# EAGLE design placaLeandro2 (EAGLE 7.6.0)
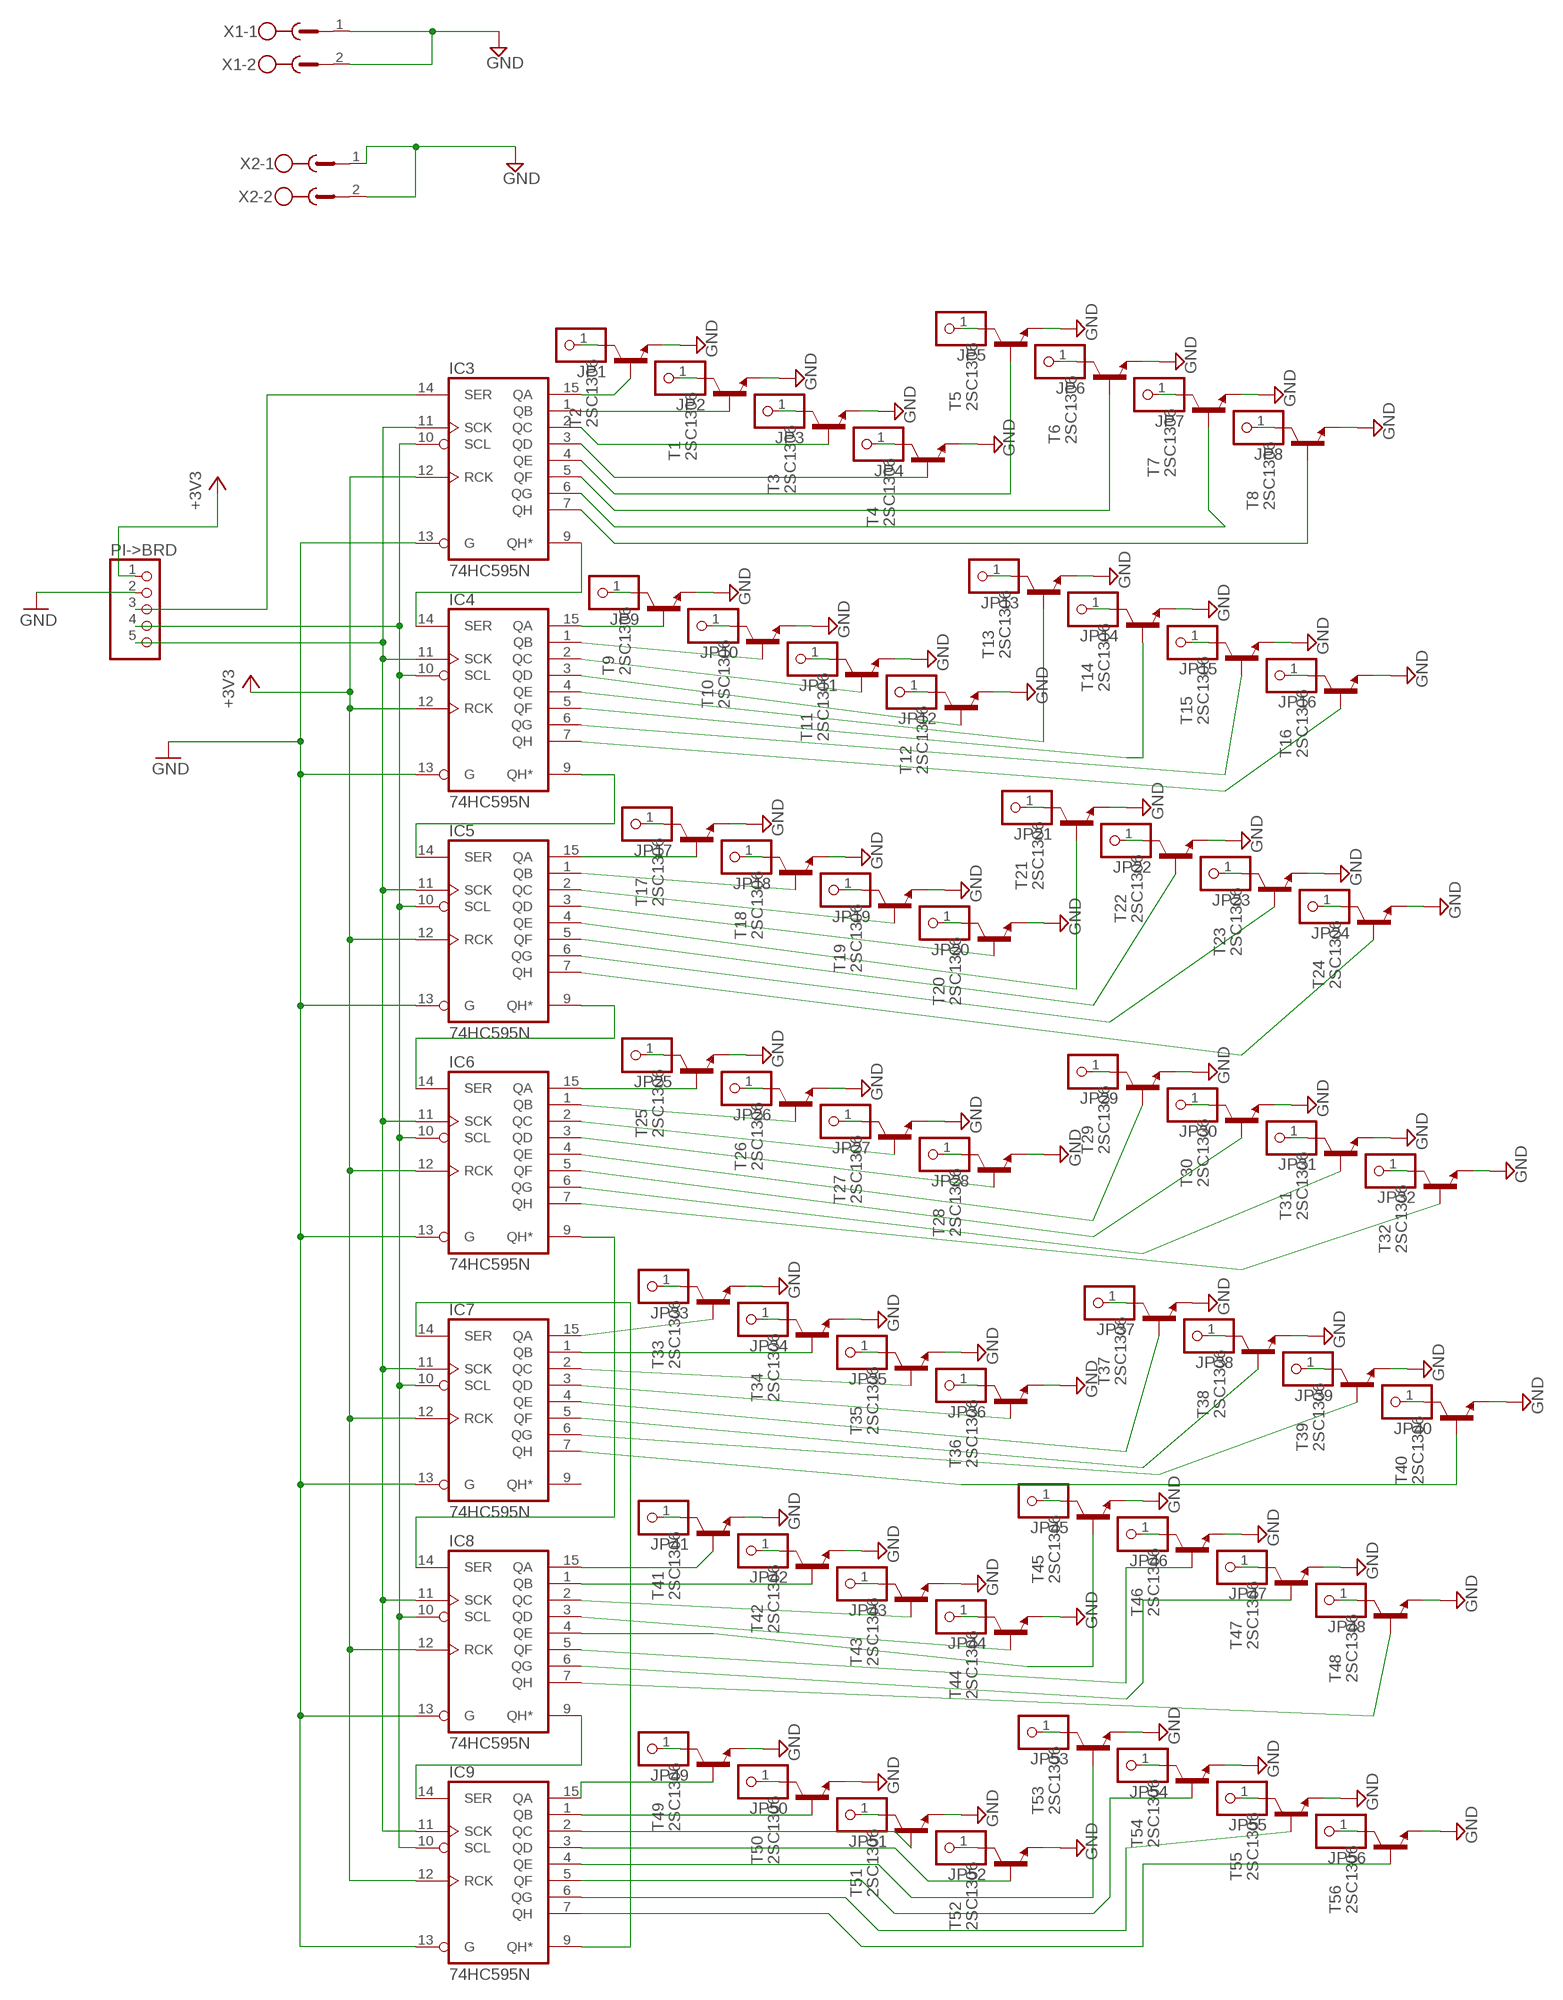
[diagram p0: schematic, sheet 1]

## Parts
IC3  74HC595N  [DIL16]
IC4  74HC595N  [DIL16]
IC5  74HC595N  [DIL16]
IC6  74HC595N  [DIL16]
IC7  74HC595N  [DIL16]
IC8  74HC595N  [DIL16]
IC9  74HC595N  [DIL16]
JP1  PINHD-1X1  [1X01]
JP2  PINHD-1X1  [1X01]
JP3  PINHD-1X1  [1X01]
JP4  PINHD-1X1  [1X01]
JP5  PINHD-1X1  [1X01]
JP6  PINHD-1X1  [1X01]
JP7  PINHD-1X1  [1X01]
JP8  PINHD-1X1  [1X01]
JP9  PINHD-1X1  [1X01]
JP10  PINHD-1X1  [1X01]
JP11  PINHD-1X1  [1X01]
JP12  PINHD-1X1  [1X01]
JP13  PINHD-1X1  [1X01]
JP14  PINHD-1X1  [1X01]
JP15  PINHD-1X1  [1X01]
JP16  PINHD-1X1  [1X01]
JP17  PINHD-1X1  [1X01]
JP18  PINHD-1X1  [1X01]
JP19  PINHD-1X1  [1X01]
JP20  PINHD-1X1  [1X01]
JP21  PINHD-1X1  [1X01]
JP22  PINHD-1X1  [1X01]
JP23  PINHD-1X1  [1X01]
JP24  PINHD-1X1  [1X01]
JP25  PINHD-1X1  [1X01]
JP26  PINHD-1X1  [1X01]
JP27  PINHD-1X1  [1X01]
JP28  PINHD-1X1  [1X01]
JP29  PINHD-1X1  [1X01]
JP30  PINHD-1X1  [1X01]
JP31  PINHD-1X1  [1X01]
JP32  PINHD-1X1  [1X01]
JP33  PINHD-1X1  [1X01]
JP34  PINHD-1X1  [1X01]
JP35  PINHD-1X1  [1X01]
JP36  PINHD-1X1  [1X01]
JP37  PINHD-1X1  [1X01]
JP38  PINHD-1X1  [1X01]
JP39  PINHD-1X1  [1X01]
JP40  PINHD-1X1  [1X01]
JP41  PINHD-1X1  [1X01]
JP42  PINHD-1X1  [1X01]
JP43  PINHD-1X1  [1X01]
JP44  PINHD-1X1  [1X01]
JP45  PINHD-1X1  [1X01]
JP46  PINHD-1X1  [1X01]
JP47  PINHD-1X1  [1X01]
JP48  PINHD-1X1  [1X01]
JP49  PINHD-1X1  [1X01]
JP50  PINHD-1X1  [1X01]
JP51  PINHD-1X1  [1X01]
JP52  PINHD-1X1  [1X01]
JP53  PINHD-1X1  [1X01]
JP54  PINHD-1X1  [1X01]
JP55  PINHD-1X1  [1X01]
JP56  PINHD-1X1  [1X01]
PI->BRD  PINHD-1X5  [1X05]
T1  2SC1306  [TO220BV]
T2  2SC1306  [TO220BV]
T3  2SC1306  [TO220BV]
T4  2SC1306  [TO220BV]
T5  2SC1306  [TO220BV]
T6  2SC1306  [TO220BV]
T7  2SC1306  [TO220BV]
T8  2SC1306  [TO220BV]
T9  2SC1306  [TO220BV]
T10  2SC1306  [TO220BV]
T11  2SC1306  [TO220BV]
T12  2SC1306  [TO220BV]
T13  2SC1306  [TO220BV]
T14  2SC1306  [TO220BV]
T15  2SC1306  [TO220BV]
T16  2SC1306  [TO220BV]
T17  2SC1306  [TO220BV]
T18  2SC1306  [TO220BV]
T19  2SC1306  [TO220BV]
T20  2SC1306  [TO220BV]
T21  2SC1306  [TO220BV]
T22  2SC1306  [TO220BV]
T23  2SC1306  [TO220BV]
T24  2SC1306  [TO220BV]
T25  2SC1306  [TO220BV]
T26  2SC1306  [TO220BV]
T27  2SC1306  [TO220BV]
T28  2SC1306  [TO220BV]
T29  2SC1306  [TO220BV]
T30  2SC1306  [TO220BV]
T31  2SC1306  [TO220BV]
T32  2SC1306  [TO220BV]
T33  2SC1306  [TO220BV]
T34  2SC1306  [TO220BV]
T35  2SC1306  [TO220BV]
T36  2SC1306  [TO220BV]
T37  2SC1306  [TO220BV]
T38  2SC1306  [TO220BV]
T39  2SC1306  [TO220BV]
T40  2SC1306  [TO220BV]
T41  2SC1306  [TO220BV]
T42  2SC1306  [TO220BV]
T43  2SC1306  [TO220BV]
T44  2SC1306  [TO220BV]
T45  2SC1306  [TO220BV]
T46  2SC1306  [TO220BV]
T47  2SC1306  [TO220BV]
T48  2SC1306  [TO220BV]
T49  2SC1306  [TO220BV]
T50  2SC1306  [TO220BV]
T51  2SC1306  [TO220BV]
T52  2SC1306  [TO220BV]
T53  2SC1306  [TO220BV]
T54  2SC1306  [TO220BV]
T55  2SC1306  [TO220BV]
T56  2SC1306  [TO220BV]
X1  MSTBV2  [MSTBV2]
X2  MSTBV2  [MSTBV2]

## Nets
+3V3: IC3.12(RCK) IC4.12(RCK) IC5.12(RCK) IC6.12(RCK) IC7.12(RCK) IC8.12(RCK) IC9.12(RCK) PI->BRD.1
GND: IC3.13(G) IC4.13(G) IC5.13(G) IC6.13(G) IC7.13(G) IC8.13(G) IC9.13(G) PI->BRD.2 T1.3(E) T2.3(E) T3.3(E) T4.3(E) T5.3(E) T6.3(E) T7.3(E) T8.3(E) T9.3(E) T10.3(E) T11.3(E) T12.3(E) T13.3(E) T14.3(E) T15.3(E) T16.3(E) T17.3(E) T18.3(E) T19.3(E) T20.3(E) T21.3(E) T22.3(E) T23.3(E) T24.3(E) T25.3(E) T26.3(E) T27.3(E) T28.3(E) T29.3(E) T30.3(E) T31.3(E) T32.3(E) T33.3(E) T34.3(E) T35.3(E) T36.3(E) T37.3(E) T38.3(E) T39.3(E) T40.3(E) T41.3(E) T42.3(E) T43.3(E) T44.3(E) T45.3(E) T46.3(E) T47.3(E) T48.3(E) T49.3(E) T50.3(E) T51.3(E) T52.3(E) T53.3(E) T54.3(E) T55.3(E) T56.3(E) X1.1 X1.2 X2.1 X2.2
N$1: IC6.9(QH*) IC8.14(SER)
N$2: IC3.9(QH*) IC4.14(SER)
N$3: IC4.9(QH*) IC5.14(SER)
N$4: IC5.9(QH*) IC6.14(SER)
N$5: IC8.9(QH*) IC9.14(SER)
N$6: IC7.14(SER) IC9.9(QH*)
N$7: IC3.11(SCK) IC4.11(SCK) IC5.11(SCK) IC6.11(SCK) IC7.11(SCK) IC8.11(SCK) IC9.11(SCK) PI->BRD.5
N$8: IC3.10(SCL) IC4.10(SCL) IC5.10(SCL) IC6.10(SCL) IC7.10(SCL) IC8.10(SCL) IC9.10(SCL) PI->BRD.4
N$9: JP1.1 T2.2(C)
N$10: JP2.1 T1.2(C)
N$11: JP3.1 T3.2(C)
N$12: IC3.14(SER) PI->BRD.3
N$13: JP4.1 T4.2(C)
N$14: JP5.1 T5.2(C)
N$15: JP6.1 T6.2(C)
N$16: JP7.1 T7.2(C)
N$17: JP8.1 T8.2(C)
N$18: JP9.1 T9.2(C)
N$19: JP10.1 T10.2(C)
N$20: JP11.1 T11.2(C)
N$21: JP12.1 T12.2(C)
N$22: JP13.1 T13.2(C)
N$23: JP14.1 T14.2(C)
N$24: JP15.1 T15.2(C)
N$25: JP16.1 T16.2(C)
N$26: JP17.1 T17.2(C)
N$27: JP18.1 T18.2(C)
N$28: JP19.1 T19.2(C)
N$29: JP20.1 T20.2(C)
N$30: JP21.1 T21.2(C)
N$31: JP22.1 T22.2(C)
N$32: JP23.1 T23.2(C)
N$33: JP24.1 T24.2(C)
N$34: JP25.1 T25.2(C)
N$35: JP26.1 T26.2(C)
N$36: JP27.1 T27.2(C)
N$37: JP28.1 T28.2(C)
N$38: JP29.1 T29.2(C)
N$39: JP30.1 T30.2(C)
N$40: JP31.1 T31.2(C)
N$41: JP32.1 T32.2(C)
N$42: JP33.1 T33.2(C)
N$43: JP34.1 T34.2(C)
N$44: JP35.1 T35.2(C)
N$45: JP36.1 T36.2(C)
N$46: JP37.1 T37.2(C)
N$47: JP38.1 T38.2(C)
N$48: JP39.1 T39.2(C)
N$49: JP40.1 T40.2(C)
N$50: JP41.1 T41.2(C)
N$51: JP42.1 T42.2(C)
N$52: JP43.1 T43.2(C)
N$53: JP44.1 T44.2(C)
N$54: JP45.1 T45.2(C)
N$55: JP46.1 T46.2(C)
N$56: JP47.1 T47.2(C)
N$57: JP48.1 T48.2(C)
N$58: JP49.1 T49.2(C)
N$59: JP50.1 T50.2(C)
N$60: JP51.1 T51.2(C)
N$61: JP52.1 T52.2(C)
N$62: JP53.1 T53.2(C)
N$63: JP54.1 T54.2(C)
N$64: JP55.1 T55.2(C)
N$65: JP56.1 T56.2(C)
N$67: IC3.1(QB) T1.1(B)
N$68: IC3.2(QC) T3.1(B)
N$69: IC3.3(QD) T4.1(B)
N$70: IC3.4(QE) T5.1(B)
N$71: IC3.5(QF) T6.1(B)
N$72: IC3.6(QG) T7.1(B)
N$73: IC3.7(QH) T8.1(B)
N$74: IC4.15(QA) T9.1(B)
N$75: IC4.1(QB) T10.1(B)
N$76: IC4.2(QC) T11.1(B)
N$77: IC4.3(QD) T12.1(B)
N$78: IC4.4(QE) T13.1(B)
N$79: IC4.5(QF) T14.1(B)
N$80: IC4.6(QG) T15.1(B)
N$81: IC4.7(QH) T16.1(B)
N$82: IC5.15(QA) T17.1(B)
N$83: IC5.1(QB) T18.1(B)
N$84: IC5.2(QC) T19.1(B)
N$85: IC5.3(QD) T20.1(B)
N$86: IC5.4(QE) T21.1(B)
N$87: IC5.5(QF) T22.1(B)
N$88: IC5.6(QG) T23.1(B)
N$89: IC5.7(QH) T24.1(B)
N$90: IC6.15(QA) T25.1(B)
N$91: IC6.1(QB) T26.1(B)
N$92: IC6.2(QC) T27.1(B)
N$93: IC6.3(QD) T28.1(B)
N$94: IC6.4(QE) T29.1(B)
N$95: IC6.5(QF) T30.1(B)
N$96: IC6.6(QG) T31.1(B)
N$97: IC6.7(QH) T32.1(B)
N$98: IC7.15(QA) T33.1(B)
N$99: IC7.1(QB) T34.1(B)
N$100: IC7.2(QC) T35.1(B)
N$101: IC7.3(QD) T36.1(B)
N$102: IC7.4(QE) T37.1(B)
N$103: IC7.5(QF) T38.1(B)
N$104: IC7.6(QG) T39.1(B)
N$105: IC7.7(QH) T40.1(B)
N$106: IC8.15(QA) T41.1(B)
N$107: IC8.1(QB) T42.1(B)
N$108: IC8.2(QC) T43.1(B)
N$109: IC8.3(QD) T44.1(B)
N$110: IC8.4(QE) T45.1(B)
N$111: IC8.5(QF) T46.1(B)
N$112: IC8.6(QG) T47.1(B)
N$113: IC8.7(QH) T48.1(B)
N$114: IC9.15(QA) T49.1(B)
N$115: IC9.1(QB) T50.1(B)
N$116: IC9.2(QC) T51.1(B)
N$117: IC9.3(QD) T52.1(B)
N$118: IC9.4(QE) T53.1(B)
N$119: IC9.5(QF) T54.1(B)
N$120: IC9.6(QG) T55.1(B)
N$121: IC9.7(QH) T56.1(B)
N$122: IC3.15(QA) T2.1(B)
Unconnected: IC7.9(QH*)

## Power pins joined to a net without a drawn wire
GND: IC3.8(GND) IC4.8(GND) IC5.8(GND) IC6.8(GND) IC7.8(GND) IC8.8(GND) IC9.8(GND)
VCC: IC3.16(VCC) IC4.16(VCC) IC5.16(VCC) IC6.16(VCC) IC7.16(VCC) IC8.16(VCC) IC9.16(VCC)

## Library data of the parts
IC3-IC9 = 74xx-eu:74*595: 8-bit SHIFT REGISTER, output latch
JP1-JP56 = pinhead:PINHD-1X1: PIN HEADER
PI->BRD = pinhead:PINHD-1X5: PIN HEADER
T1-T56 = transistor-neu-to92:2SC1306: NPN Transistor Final RF Power Outupt Source: 2sc1306.pdf
X1 X2 = con-phoenix-500:MSTBV2: PHOENIX; OC_FARNELL: unknown; OC_NEWARK: unknown

## Board
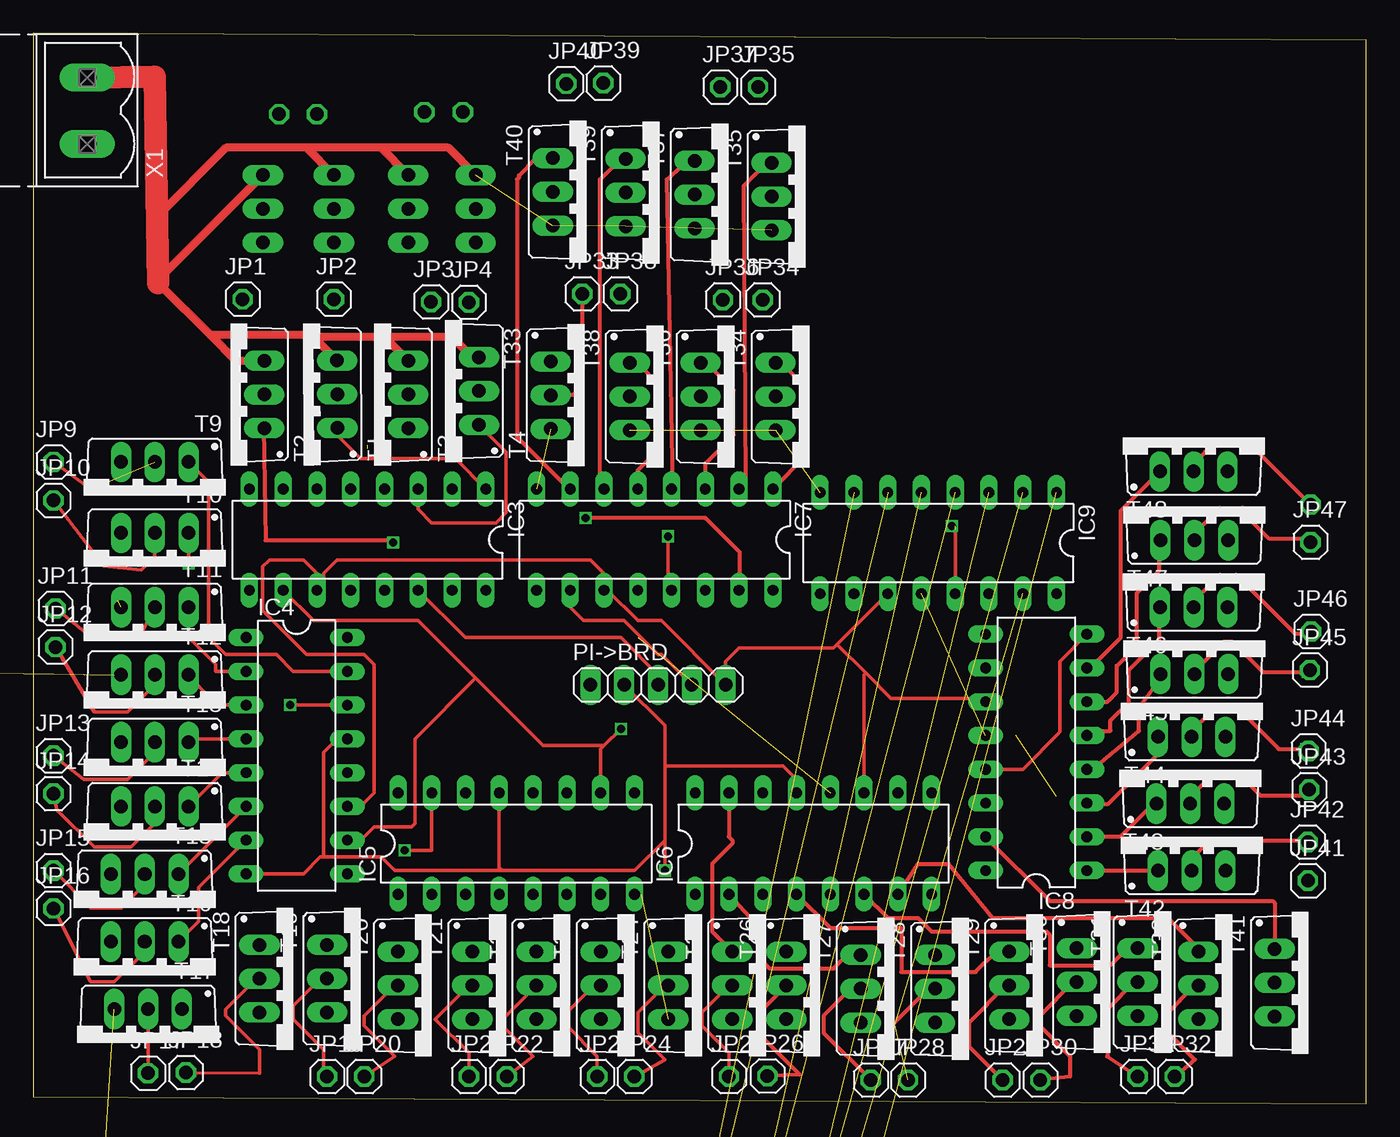
[diagram p1: board, top side]
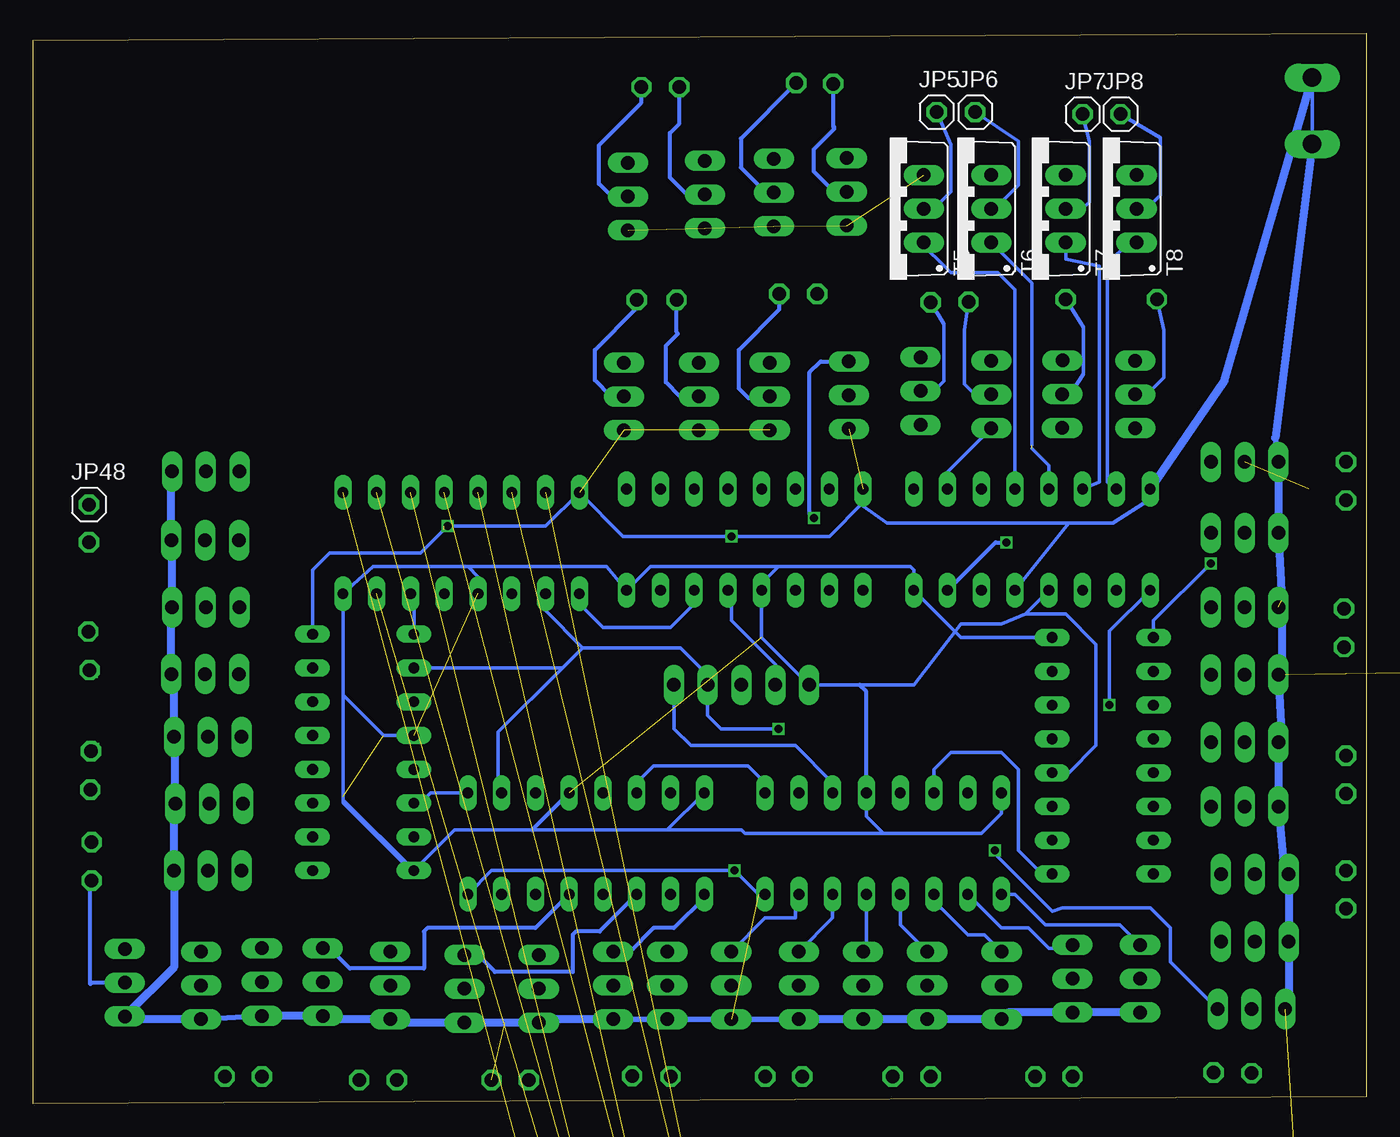
[diagram p2: board, bottom side, seen from below]

Size 100.25 x 80.51 mm. Coordinates in mm from the lower left corner, seen from the top.
Outline: 0,0.51 100.25,0 100.25,80 0,80.51 0,0.51
Copper layers (1*16): Top 0.035mm / dielectric 1.5mm / Bottom 0.035mm
Design rules "SeeedStudio_2layer_DRU_no_angle_20140221 *": minimum track width 8mil, minimum drill 12mil, track to track 10mil, track to pad 10mil, pad to pad 10mil, via to via 10mil, smd to smd 0mil, copper to edge 10mil, drill to drill 10mil, minimum pad ring 10mil, minimum via ring 6mil, stop-mask expansion 2mil, vias tented up to drill 100mil, thermal gap 10mil

### Footprints (pad centres in the part's own frame; a part is rotated, then mirrored left to right if it is on the bottom)
DIL16 = drill 0.813 long: 1 -8.89,-3.81; 2 -6.35,-3.81; 3 -3.81,-3.81; 4 -1.27,-3.81; 5 1.27,-3.81; 6 3.81,-3.81; 7 6.35,-3.81; 8 8.89,-3.81; 9 8.89,3.81; 10 6.35,3.81; 11 3.81,3.81; 12 1.27,3.81; 13 -1.27,3.81; 14 -3.81,3.81; 15 -6.35,3.81; 16 -8.89,3.81
1X01 = drill 1.016 octagon: 1 0,0
1X05 = drill 1.016 long: 1 -5.08,0; 2 -2.54,0; 3 0,0; 4 2.54,0; 5 5.08,0
TO220BV = drill 1.016 long: 1 -2.54,-2.54; 2 0,-2.54; 3 2.54,-2.54
MSTBV2 = drill 1.397 long: 1 -2.5,0; 2 2.5,0

### Placement (x,y rotation side)
IC3  25.15,42.42 180 top
IC4  19.81,26.16 270 top
IC5  36.32,19.56 0 top
IC6  58.67,19.56 0 top
IC7  46.74,42.42 180 top
IC8  75.44,26.42 90 top
IC9  68.07,42.16 180 top
JP1  15.75,60.5 0 top
JP2  22.61,60.5 0 top
JP3  29.92,60.3 0 top
JP4  32.76,60.26 0 top
JP5  32.31,74.57 0 bottom
JP6  29.41,74.57 0 bottom
JP7  21.34,74.42 0 bottom
JP8  18.49,74.42 0 bottom
JP9  1.52,48.26 0 top
JP10  1.52,45.36 0 top
JP11  1.68,37.24 0 top
JP12  1.68,34.34 0 top
JP13  1.52,26.16 0 top
JP14  1.52,23.32 0 top
JP15  1.52,17.53 0 top
JP16  1.52,14.68 0 top
JP17  8.64,2.29 0 top
JP18  11.48,2.34 0 top
JP19  22.1,2.03 0 top
JP20  24.89,2.03 0 top
JP21  32.77,2.03 0 top
JP22  35.61,2.03 0 top
JP23  42.42,2.03 0 top
JP24  45.21,2.03 0 top
JP25  52.32,2.03 0 top
JP26  55.22,2.08 0 top
JP27  62.99,1.78 0 top
JP28  65.79,1.78 0 top
JP29  72.9,1.78 0 top
JP30  75.74,1.78 0 top
JP31  83.06,2.03 0 top
JP32  85.85,2.03 0 top
JP33  41.3,60.91 0 top
JP34  54.86,60.45 0 top
JP35  54.51,76.45 0 top
JP36  51.87,60.45 0 top
JP37  51.66,76.45 0 top
JP38  44.15,60.91 0 top
JP39  42.88,76.76 0 top
JP40  40.08,76.71 0 top
JP41  95.86,16.76 0 top
JP42  95.86,19.66 0 top
JP43  95.96,23.62 0 top
JP44  95.91,26.52 0 top
JP45  96.01,32.61 0 top
JP46  96.11,35.51 0 top
JP47  96.06,42.21 0 top
JP48  96.06,45.06 0 bottom
JP49  -9.91,-343.92 0 top  (outside the outline)
JP50  -32,-353.06 0 top  (outside the outline)
JP51  -27.18,-353.06 0 top  (outside the outline)
JP52  -22.35,-353.06 0 top  (outside the outline)
JP53  -17.53,-353.06 0 top  (outside the outline)
JP54  -12.7,-353.06 0 top  (outside the outline)
JP55  -7.87,-353.06 0 top  (outside the outline)
JP56  -32,-358.14 0 top  (outside the outline)
PI->BRD  46.99,31.5 0 top
T1  20.32,53.34 90.3 top
T2  14.83,53.34 90 top
T3  25.65,53.34 90 top
T4  30.99,53.59 90 top
T5  35.81,67.31 90 bottom
T6  30.73,67.31 90 bottom
T7  25.15,67.31 90 bottom
T8  19.81,67.31 90 bottom
T9  9.14,45.72 180 top
T10  9.14,40.39 180 top
T11  9.14,34.8 180 top
T12  9.14,29.72 180 top
T13  9.14,24.64 180 top
T14  9.14,19.81 180 top
T15  8.38,14.73 180 top
T16  8.38,9.65 180 top
T17  8.64,4.57 180 top
T18  19.56,9.4 270 top
T19  24.64,9.4 270 top
T20  29.97,8.89 270 top
T21  35.56,8.89 270 top
T22  40.39,8.89 270 top
T23  45.21,8.89 270 top
T24  50.29,8.89 270 top
T25  55.12,8.89 270 top
T26  59.18,8.89 270 top
T27  64.77,8.64 270 top
T28  70.36,8.64 270 top
T29  75.95,8.89 270 top
T30  81.03,9.14 270 top
T31  85.6,9.14 270 top
T32  90.17,8.89 270 top
T33  41.45,53.29 270 top
T34  58.37,53.19 270 top
T35  58.06,68.22 270 top
T36  52.73,53.19 270 top
T37  52.27,68.38 270 top
T38  47.4,53.19 270 top
T39  47.09,68.53 270 top
T40  41.61,68.58 270 top
T41  95.91,9.09 270 top
T42  87.12,20.07 0 top
T43  87.02,25.1 0 top
T44  87.12,30.12 0 top
T45  87.33,34.85 0 top
T46  87.27,39.88 0 top
T47  87.33,44.91 0 top
T48  87.27,50.09 0 top
T49  -28.19,-313.94 0 top  (outside the outline)
T50  -17.27,-313.94 0 top  (outside the outline)
T51  -28.19,-323.09 0 top  (outside the outline)
T52  -17.27,-323.09 0 top  (outside the outline)
T53  -28.19,-332.23 0 top  (outside the outline)
T54  -17.27,-332.23 0 top  (outside the outline)
T55  -28.19,-341.38 0 top  (outside the outline)
T56  -17.27,-341.38 0 top  (outside the outline)
X1  4.06,74.68 90 top
X2  -28.19,32.77 0 top  (outside the outline)

### Tracks (layer width: path | path; a pad name or v marks a point on that pad's centre or on a via)
+3V3  (3 unrouted)
  Bottom 0.254: 25.65,36.83 27.43,36.07 30.48,36.07 34.04,31.5 38.1,31.5 PI->BRD.1 45.47,35.05 IC7.12 45.47,39.12 44.2,40.39 44.45,40.39 | 25.65,36.83 IC3.12 | 36.32,20.32 37.59,21.59 IC5.12 | IC9.12 66.8,39.62 67.56,40.39 | IC8.12 73.91,27.69 76.96,30.73 | IC4.12 22.35,24.89 20.32,26.92 20.32,34.54 22.61,36.83 25.65,36.83 | 62.74,20.57 68.58,20.57 71.63,17.53 71.63,17.27 76.96,22.61 76.96,23.11
  Bottom 0.305: IC5.12 37.59,30.99 38.1,31.5 | IC6.12 62.74,20.57
GND  (via drill 0.6)  (21 unrouted)
  Top 0.254: v69.09,43.43 69.34,43.43 IC9.13 | IC7.13 47.75,38.86 v47.75,42.67 | IC8.8 77.22,33.27 77.22,27.94 74.42,25.15 IC8.13 | PI->BRD.2 47.5,28.45 47.5,25.4 | 47.5,25.4 47.5,19.81 | 47.5,19.81 v47.5,17.53 | IC6.13 57.4,24.38 56.39,25.4 47.5,25.4 | 35.31,17.53 27.18,17.53 26.16,18.54 21.84,18.54 | 35.31,17.53 45.21,17.53 47.5,19.81 | IC5.13 35.05,17.78 35.31,17.53 | IC4.8 20.32,17.27 21.59,18.54 21.84,18.54 | IC4.13 22.86,27.43 21.84,26.42 21.84,18.54
  Top 0.61: 9.53,61.59 9.4,61.72 9.4,66.8 14.48,71.88 20.57,71.88 | 9.53,61.59 13.33,57.78 | 13.33,57.78 15.24,55.88 T2.3 | T8.3 9.65,62.23 9.65,61.72 9.53,61.59 | T7.3 20.57,71.88 | T1.3 21.08,57.66 | 21.08,57.66 20.96,57.78 13.33,57.78 | T3.3 26.42,57.66 | 26.42,57.66 21.08,57.66 | T4.3 33.02,56.13 31.5,57.66 26.42,57.66 | T6.3 26.16,71.88 | 26.16,71.88 20.57,71.88 | T5.3 31.24,71.88 26.16,71.88
  Top 1.676: X1.2 9.14,77.26 9.4,61.72
  Bottom 0.254: IC3.8 16.26,45.47 19.05,43.69 22.35,43.69 | 22.35,43.69 IC3.13 | IC7.8 37.85,45.21 | 37.85,45.21 37.85,44.96 36.07,43.69 22.35,43.69 | 37.85,45.21 40.39,42.67 v47.75,42.67 55.88,42.67 IC9.8 61.72,43.43 v69.09,43.43 | 69.34,43.18 71.12,41.4 77.98,41.4 79.25,40.13 IC8.8 | IC5.8 45.72,15.75 v47.5,17.53 65.79,17.53 IC6.8 | PI->BRD.2 44.45,33.02 47.75,36.32 47.75,38.35 IC7.13 | X1.2 X1.1
  Bottom 0.406: 6.86,50.08 T9.3 | 6.35,32.51 6.1,32.26 T12.3 | 6.35,27.18 T13.3 | 6.1,16.51 T15.3 | 5.84,7.37 T17.3 | T23.3 T24.3 T25.3 T26.3 | T31.3 T32.3
  Bottom 0.61: IC3.8 10.67,54.36 X1.2 | X1.1 6.86,50.08 | T9.3 T10.3 6.35,37.85 6.35,32.51 | T12.3 6.35,27.18 | T13.3 T14.3 6.1,16.51 | T15.3 T16.3 5.84,7.37 | T18.3 T19.3 26.92,6.86 T20.3 T21.3 T22.3 T23.3 | T26.3 61.98,6.35 T27.3 T28.3 73.15,6.1 T29.3 78.23,6.35 T30.3 T31.3 | T32.3 93.17,6.35 T41.3 89.66,10.26 T42.3 89.66,22.45 T43.3 89.56,27.48 T44.3 89.66,32.11 T45.3 89.87,37.29 T46.3 89.81,42.32 T47.3 89.87,47.5 T48.3
N$1
  Bottom 0.254: IC6.9 70.36,23.37 71.63,22.1 IC8.14
N$2  (via drill 0.6)
  Top 0.254: IC4.14 v19.3,29.97
  Bottom 0.254: v19.3,29.97 19.3,35.56 IC3.9
N$3
  Bottom 0.254: IC4.9 24.38,17.27 26.16,19.05 26.16,25.15 27.43,26.42 31.24,26.42 32.51,25.15 IC5.14
N$4
  Bottom 0.254: IC5.9 45.21,24.13 46.48,25.4 53.59,25.4 54.86,24.13 IC6.14
N$5
  Bottom 0.254: IC8.9 71.63,38.1 IC9.14
N$6
  Bottom 0.254: IC9.9 59.18,37.59 57.4,35.81 52.32,35.81 50.29,37.85 50.29,38.35 IC7.14
N$7
  Top 0.254: 60.45,34.54 60.2,34.29 53.09,34.29 52.07,33.27 PI->BRD.5 47.24,36.32 45.47,36.32 43.18,38.61 IC7.11 42.93,39.88 41.91,40.89 22.86,40.89 21.84,39.88 21.84,38.61 IC3.11 21.34,39.88 20.32,40.89 17.78,40.89 17.27,40.39 17.27,37.08 20.57,33.78 24.89,33.78 25.65,33.02 25.65,23.37 24.64,22.35 IC4.11 | 60.45,34.54 IC9.11 | IC8.11 71.63,30.48 64.52,30.48 62.61,32.38 | 62.61,32.38 60.45,34.54 | IC6.11 62.48,32.26 62.61,32.38
  Bottom 0.254: IC5.11 40.13,24.13 42.93,26.92 50.8,26.92 52.07,28.19 PI->BRD.5
N$8  (via drill 0.6)
  Top 0.254: IC7.10 40.39,37.34 41.4,36.32 44.45,36.32 46.99,33.78 47.24,33.78 PI->BRD.4 | v44.2,28.19 42.93,26.92 | 42.93,26.92 42.67,26.67 IC5.10 | IC3.10 21.08,36.32 28.96,36.32 33.27,32 | 33.27,32 38.35,26.92 42.93,26.92 | IC4.10 24.64,19.81 25.65,20.83 28.45,20.83 28.7,21.08 28.7,27.43 33.27,32
  Bottom 0.254: IC9.10 61.72,37.08 58.93,34.29 | 58.93,34.29 51.56,34.29 49.53,32.26 PI->BRD.4 49.53,29.21 48.51,28.19 v44.2,28.19 | IC8.10 60.45,32.77 | 60.45,32.77 58.93,34.29 | IC6.10 65.28,23.37 65.28,27.94 60.45,32.77
N$9
  Bottom 0.254: JP1.1 15.24,58.17 15.24,54.61 16.51,53.34 T2.2
N$10
  Bottom 0.254: 22.86,60.45 JP2.1 21.29,58.42 21.29,54.86 22.1,53.59 23.37,53.59 23.13,53.35 T1.2
N$11
  Bottom 0.254: JP3.1 30.23,58.17 30.23,54.1 29.21,53.09 28.7,53.09 28.45,53.34 T3.2
N$12
  Top 0.254: PI->BRD.3 46.99,32.26 44.2,35.05 32.51,35.05 IC3.14
N$13
  Bottom 0.254: JP4.1 31.75,58.65 31.75,54.36 32.51,53.59 T4.2
N$14
  Bottom 0.254: JP5.1 31.24,72.14 31.24,68.58 32.51,67.31 T5.2
N$15
  Bottom 0.254: JP6.1 26.16,72.39 26.16,69.09 27.94,67.31 T6.2
N$16
  Bottom 0.254: JP7.1 20.83,72.39 20.83,67.82 21.34,67.31 T7.2
N$17
  Bottom 0.254: JP8.1 15.49,72.64 15.49,68.33 16.51,67.31 T8.2
N$18  (1 unrouted)
  Top 0.254: 4.32,46.23 JP9.1
N$19
  Top 0.254: JP10.1 5.28,40.44 8.13,40.13 9.14,41.15 T10.2
N$20
  Top 0.254: JP11.1 4.06,35.31 8.13,35.31 T11.2
N$21
  Top 0.254: T12.2 9.14,31.5 7.11,29.46 4.57,29.46 JP12.1
N$22
  Top 0.254: JP13.1 3.81,24.38 7.11,24.38 9.14,26.42 T13.2
N$23
  Top 0.254: JP14.1 1.78,22.1 4.57,19.3 7.37,19.3 9.14,21.08 T14.2
N$24
  Top 0.254: T15.2 8.38,16.51 6.6,14.73 4.32,14.73 JP15.1
N$25
  Top 0.254: T16.2 8.38,11.43 6.1,9.14 4.32,9.14 JP16.1
N$26
  Top 0.254: T17.2 JP17.1
N$27
  Top 0.254: T18.2 16.76,9.4 14.48,7.11 14.48,6.6 17.02,4.06 17.02,2.29 JP18.1
N$28
  Top 0.254: T19.2 21.59,9.4 19.56,7.37 19.56,6.35 21.84,4.06 21.84,2.29 JP19.1
N$29
  Top 0.254: T20.2 27.18,8.89 24.89,6.6 24.89,5.84 27.18,3.56 JP20.1
N$30
  Top 0.254: T21.2 32.77,8.89 30.23,6.35 32.77,3.81 JP21.1
N$31
  Top 0.254: T22.2 35.31,6.35 35.31,5.84 37.59,3.56 JP22.1
N$32
  Top 0.254: T23.2 42.16,8.89 40.13,6.86 40.13,5.84 42.42,3.56 JP23.1
N$33
  Top 0.254: T24.2 47.5,8.89 45.47,6.86 45.47,5.33 47.5,3.3 JP24.1
N$34
  Top 0.254: T25.2 52.32,8.89 50.29,6.86 50.29,5.84 52.32,3.81 JP25.1
N$35
  Top 0.305: T26.2 54.61,6.86 54.61,5.23 57.66,2.18 JP26.1
N$36
  Top 0.305: T27.2 61.47,8.64 59.44,6.6 59.44,5.33 JP27.1
N$37  (1 unrouted)
  Top 0.305: T28.2 67.31,8.64 64.77,6.1
N$38
  Top 0.305: T29.2 73.15,8.89 70.36,6.1 70.36,4.32 JP29.1
N$39
  Top 0.305: T30.2 78.23,9.14 75.69,6.6 75.69,5.84 77.98,3.56 77.98,2.03 JP30.1
N$40
  Top 0.305: T31.2 82.8,9.14 80.77,7.11 80.77,3.56 JP31.1
N$41
  Top 0.305: T32.2 87.38,8.89 85.09,6.6 85.09,5.59 87.38,3.3 JP32.1
N$42
  Top 0.305: T33.2 38.96,53.34 40.64,53.34 41.3,54 JP33.1
N$43
  Bottom 0.305: T34.2 56.79,53.19 58.01,54.41 58.01,56.69 54.86,59.84 JP34.1
N$44
  Bottom 0.305: T35.2 55.57,68.28 56.79,68.28 57.71,69.19 57.71,72.08 54.51,75.29 JP35.1
N$45
  Bottom 0.305: T36.2 51.61,53.19 52.68,54.25 52.68,57 51.77,57.91 51.87,58.01 JP36.1
N$46
  Bottom 0.305: T37.2 49.78,68.43 51.16,68.43 52.38,69.65 52.38,73 51.66,73.71 JP37.1
N$47
  Bottom 0.305: T38.2 45.01,53.03 46.43,53.03 47.19,53.8 47.19,56.69 44.14,59.74 JP38.1
N$48
  Bottom 0.305: JP39.1 47.04,72.59 47.04,70.41 45.16,68.53 T39.2
N$49
  Bottom 0.305: T40.2 40.03,68.58 41.55,70.1 41.55,71.78 40.03,73.3 40.03,73.46 40.08,73.51 JP40.1
N$50
  Bottom 0.305: T41.2 95.86,9.09 95.96,8.99 95.96,16.66 JP41.1
N$51
  Top 0.305: T42.2 87.12,18.44 88.49,19.81 95.71,19.81 JP42.1
N$52
  Top 0.305: T43.2 87.02,23.06 88.65,24.69 90.78,24.69 92.3,23.16 95.5,23.16 JP43.1
N$53  (via drill 0.6)
  Top 0.305: T44.2 87.12,28.04 89.1,30.02 90.32,30.02 93.68,26.67 v95.76,26.67
  Bottom 0.305: v95.76,26.67 JP44.1
N$54  (via drill 0.6)
  Top 0.305: T45.2 87.33,32.51 89.56,34.75 90.17,34.75 92.46,32.46 v95.86,32.46
  Bottom 0.305: v95.86,32.46 JP45.1
N$55
  Top 0.305: T46.2 87.27,37.8 89.26,39.78 90.48,39.78 94.89,35.36 95.96,35.36 JP46.1
N$56
  Top 0.305: T47.2 87.33,42.88 89.26,44.81 90.93,44.81 91.08,44.65 91.08,44.35 92.91,42.52 95.76,42.52 JP47.1
N$57
  Top 0.305: T48.2 87.27,48.16 88.95,49.84 91.29,49.84 JP48.1
N$58  (1 unrouted)
N$59  (1 unrouted)
N$60  (1 unrouted)
N$61  (1 unrouted)
N$62  (1 unrouted)
N$63  (1 unrouted)
N$64  (1 unrouted)
N$65  (1 unrouted)
N$67
  Top 0.254: IC3.1 31.75,48.51 24.64,48.51 22.87,50.28 T1.1
N$68
  Bottom 0.254: IC3.2 31.5,47.5 T3.1
N$69
  Top 0.254: IC3.3 28.96,44.7 29.97,43.69 34.8,43.69 35.56,44.45 35.56,49.02 T4.1
N$70
  Bottom 0.254: IC3.4 26.42,61.21 27.69,62.48 31.24,62.48 33.78,65.02 33.53,65.02 T5.1
N$71  (1 unrouted)
  Bottom 0.254: IC3.5 23.88,48.01 25.15,49.28 | 25.15,49.53 25.15,61.72 T6.1
N$72
  Bottom 0.254: IC3.6 20.07,46.74 20.07,62.99 22.61,63.5 T7.1
N$73
  Bottom 0.254: IC3.7 19.46,46.74 19.46,63.25 17.78,64.77 T8.1
N$74
  Top 0.254: IC4.15 19.56,32.51 18.29,33.78 14.48,33.78 13.21,35.05 13.21,46.74 T9.1
N$75  (via drill 0.6)
  Top 0.254: v11.68,40.64 T10.1
  Bottom 0.254: IC4.1 16,36.32 v11.68,40.64
N$76
  Top 0.254: IC4.2 13.72,32.51 13.72,33.02 11.68,35.05 T11.1
N$77
  Top 0.254: IC4.3 13.72,29.97 T12.1
N$78
  Top 0.254: IC4.4 11.94,27.43 T13.1
N$79
  Top 0.254: IC4.5 14.22,24.89 T14.1
N$80
  Top 0.254: IC4.6 T15.1
N$81
  Top 0.254: IC4.7 15.49,19.81 15.49,19.3 12.45,16.26 12.45,13.72 T16.1
N$82  (via drill 0.6)
  Top 0.254: IC5.15 29.97,19.05 v27.94,19.05
  Bottom 0.254: v27.94,19.05 27.94,18.8 23.62,14.48 22.86,14.73 16.26,14.73 14.73,13.21 14.73,10.67 T17.1
N$83
  Bottom 0.254: IC5.1 26.42,15.75 24.13,13.46 18.54,13.46 T18.1
N$84
  Bottom 0.254: IC5.2 27.43,13.21 25.4,13.21 23.88,11.68 22.35,11.68 T19.1
N$85
  Bottom 0.254: IC5.3 32.51,14.73 32,14.73 29.97,12.7 28.7,12.7 T20.1
N$86
  Bottom 0.254: IC5.4 35.05,13.46 T21.1
N$87
  Bottom 0.254: IC5.5 37.59,11.68 T22.1
N$88
  Bottom 0.254: IC5.6 40.13,13.97 T23.1
N$89
  Bottom 0.254: IC5.7 42.93,15.49 42.93,13.97 45.21,13.97 T24.1
N$90
  Top 0.305: IC6.15 52.32,20.07 52.58,19.81 52.58,19.56 51.05,18.03 51.05,12.95 T25.1
N$91
  Bottom 0.305: IC6.1 49.78,15.49 52.07,13.21 53.59,13.21 55.37,11.43 T26.1
N$92
  Top 0.305: IC6.2 54.61,13.21 54.61,10.92 55.37,10.16 60.2,10.16 61.47,11.43 T27.1
N$93
  Bottom 0.305: IC6.3 57.66,12.95 59.44,12.95 59.69,12.7 59.69,9.91 65.53,9.91 66.8,11.18 T28.1
N$94
  Top 0.305: IC6.4 59.94,13.21 65.28,13.21 65.28,9.91 70.87,9.91 72.39,11.43 T29.1
N$95
  Bottom 0.305: IC6.5 62.48,13.21 70.61,13.21 70.87,12.95 70.87,10.16 76.45,10.16 77.98,11.68 T30.1
N$96
  Top 0.305: IC6.6 64.26,13.97 66.55,13.97 67.56,12.95 76.2,12.95 76.45,12.7 76.45,10.41 81.03,10.41 82.3,11.68 T31.1
N$97
  Top 0.305: IC6.7 66.55,18.03 68.83,18.03 72.14,13.97 85.34,13.97 87.63,11.68 T32.1
N$98  (via drill 0.6)
  Top 0.305: IC7.15 53.14,38.66 53.14,41.45 50.55,44.04 v41.55,44.04
  Bottom 0.305: v41.55,44.04 41.86,44.35 41.86,55.02 41.05,55.83 T33.1
N$99
  Top 0.305: IC7.1 58.17,48.77 58.17,53.8 56.24,55.73 T34.1
N$100
  Top 0.305: IC7.2 53.59,46.58 53.44,69.04 55.17,70.76 T35.1
N$101
  Top 0.305: IC7.3 50.55,48.16 52.68,50.29 52.68,53.65 50.6,55.73 T36.1
N$102
  Top 0.305: IC7.4 48.11,46.43 47.65,69.49 49.22,70.92 T37.1
N$103
  Top 0.305: T38.1 45.41,55.73 47.19,53.95 47.19,49.38 45.47,47.65 IC7.5
N$104
  Top 0.305: IC7.6 42.62,46.53 42.62,69.49 44.2,71.07 T39.1
N$105
  Top 0.305: T40.1 38.96,71.02 37.74,71.02 36.52,69.8 36.52,69.65 36.37,69.49 36.37,50.14 40.28,46.23 IC7.7
N$106
  Top 0.305: IC8.15 76.45,15.24 93.22,15.24 93.37,15.09 T41.1
N$107
  Top 0.305: IC8.1 T42.1
N$108
  Top 0.305: IC8.2 79.3,20.12 81.79,20.12 84.23,22.55 T43.1
N$109
  Top 0.305: IC8.3 79.3,22.55 80.87,22.55 84.58,26.26 T44.1
N$110
  Top 0.305: IC8.4 79.65,25.15 83.16,28.04 83.16,29.72 84.79,31.95 T45.1
N$111
  Top 0.305: IC8.5 79.6,28.04 81.03,28.04 81.03,28.8 82.4,30.18 82.4,32.61 84.38,34.59 84.68,34.59 84.68,37.29 T46.1
N$112
  Top 0.305: IC8.6 80.77,30.23 81.48,30.94 81.48,32.92 83.01,34.44 83.01,38.41 84.68,40.08 84.68,42.27 T47.1
N$113
  Top 0.305: IC8.7 79.5,32.77 81.79,35.05 81.79,44.6 T48.1
N$114  (1 unrouted)
N$115  (1 unrouted)
N$116  (1 unrouted)
N$117  (1 unrouted)
N$118  (1 unrouted)
N$119  (1 unrouted)
N$120  (1 unrouted)
N$121  (1 unrouted)
N$122  (via drill 0.6)
  Top 0.305: v27.08,42.22 26.92,42.37 17.48,42.37 17.53,42.42 T2.1
  Bottom 0.305: IC3.15 27.89,42.22 v27.08,42.22
VCC
  Bottom 0.254: IC4.16 30.48,35.05 IC3.16 34.04,40.13 34.29,40.39 53.85,40.39 IC7.16 57.15,40.39 74.68,40.39 IC9.16 76.96,22.86 IC8.16 68.58,20.57 52.58,20.57 | IC5.16 27.43,21.84 28.96,20.32 46.74,20.32 46.99,20.57 52.58,20.57 | IC6.16 52.58,20.57